# Altium schematic sheet Sheet2.SchDoc
size A4
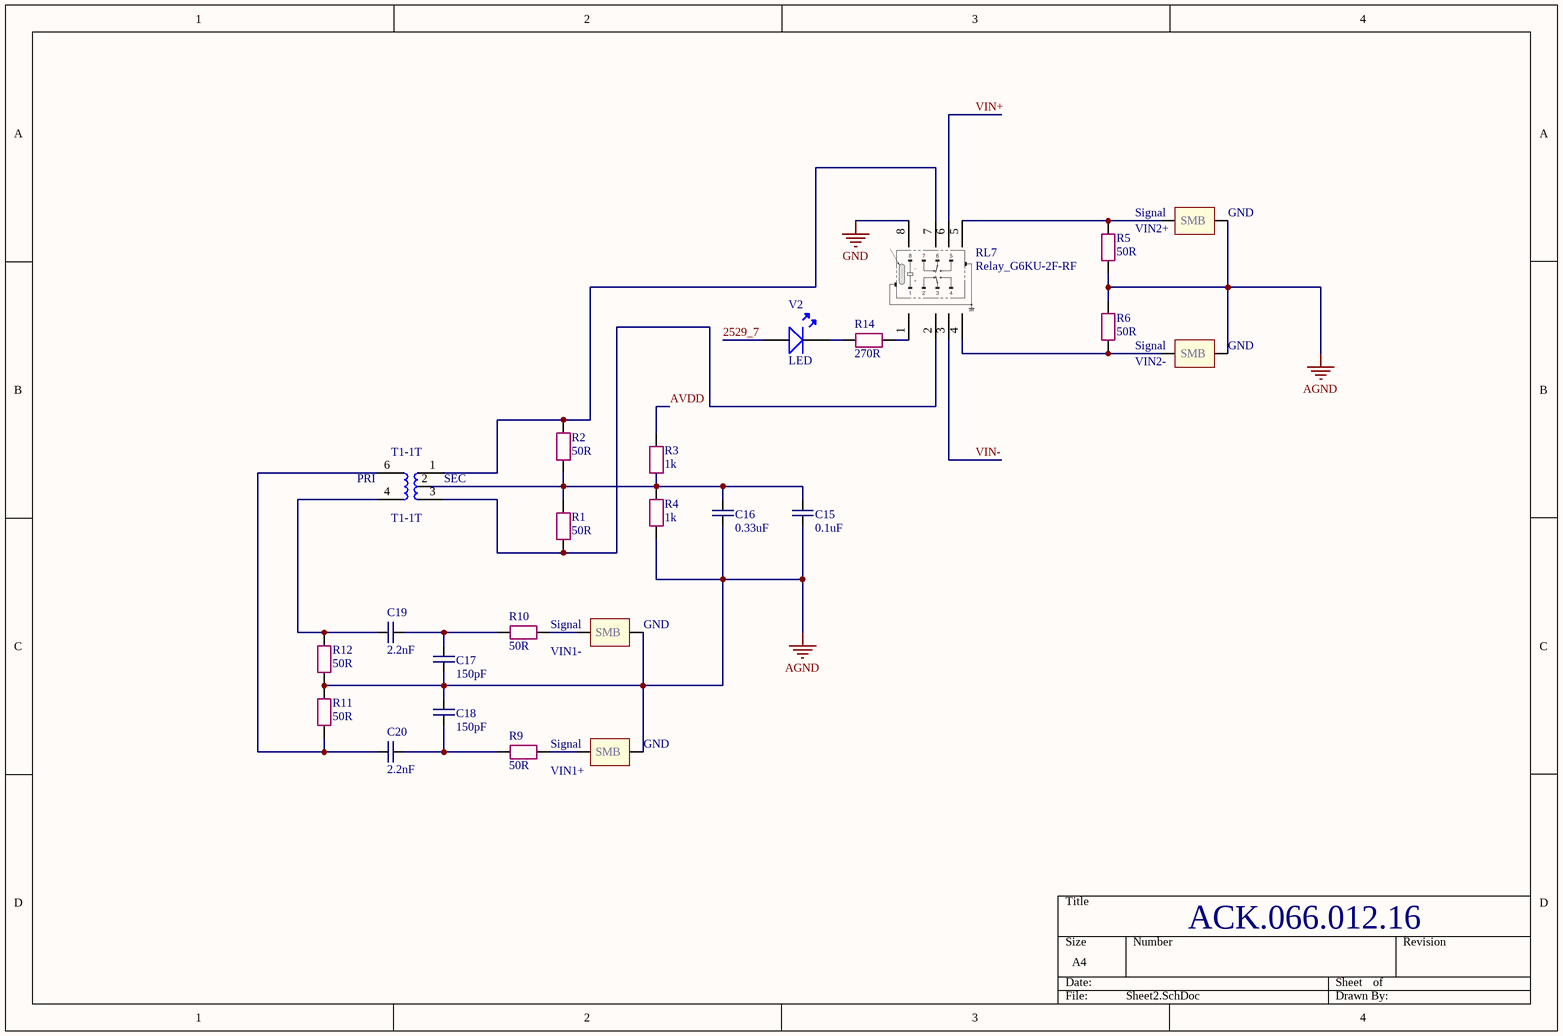
[diagram p0: Sheet2.SchDoc]

## Parts
C15  0.1uF  [C_0805]
C16  0.33uF  [C_0805]
C17  150pF  [C_0805]
C18  150pF  [C_0805]
C19  2.2nF  [C_0805]
C20  2.2nF  [C_0805]
R1  50R  [R_0805]
R2  50R  [R_0805]
R3  1k  [R_0805]
R4  1k  [R_0805]
R5  50R  [R_0805]
R6  50R  [R_0805]
R9  50R  [R_0805]
R10  50R  [R_0805]
R11  50R  [R_0805]
R12  50R  [R_0805]
R14  270R  [R_0805]
RL7  Relay_G6KU-2F-RF  [Relay_G6KU-2F-RF]
T1-1T  T1-1T  [T1-1T]
V2  LED  [LED]
VIN1+  SMB  [SMB]  (value not drawn)
VIN1-  SMB  [SMB]  (value not drawn)
VIN2+  SMB  [SMB]  (value not drawn)
VIN2-  SMB  [SMB]  (value not drawn)

## Nets
AGND: C15.1 C16.1 C17.1 C18.2 R4.1 R5.1 R6.2 R11.2 R12.1 VIN1+.0 VIN1-.0 VIN2+.0 VIN2-.0
GND: RL7.8
2529_7: V2.1
AVDD: R3.2
VIN+: RL7.6
VIN-: RL7.3
NetC15_2: C15.2 C16.2 R1.2 R2.1 R3.1 R4.2 T1-1T.2(SEC_CT)
NetC17_2: C17.2 C19.1 R10.1
NetC18_1: C18.1 C20.1 R9.1
NetC19_2: C19.2 R12.2 T1-1T.4(PRIM_DOT)
NetC20_2: C20.2 R11.1 T1-1T.6(PRIM)
NetR1_1: R1.1 RL7.2 T1-1T.3(SEC_DOT)
NetR2_2: R2.2 RL7.7 T1-1T.1(SEC)
NetR5_2: R5.2 RL7.5 VIN2+.1
NetR6_1: R6.1 RL7.4 VIN2-.1
NetR9_2: R9.2 VIN1+.1
NetR10_2: R10.2 VIN1-.1
NetR14_1: R14.1 RL7.1
NetR14_2: R14.2 V2.2

## Notes on the sheet
- ACK.066.012.16
- (in symbol SMB) Signal; GND
- (in symbol T1-1T) PRI

## Library data of the parts
C15-C20 = capacitor 0805
R1-R6 R9-R12 R14 = resistor 0805